# Altium schematic sheet User Interface.SchDoc
size A4
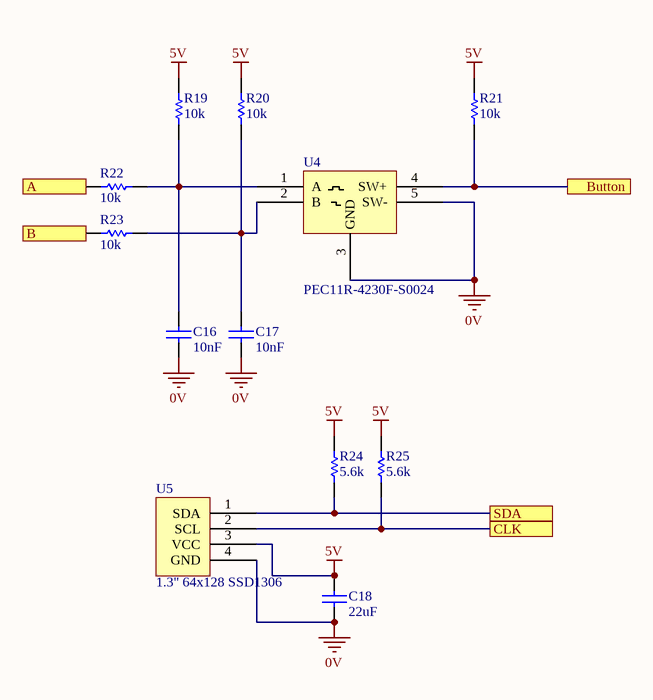
[diagram p0: User Interface.SchDoc]

## Parts
C16  10nF  [0805]
C17  10nF  [0805]
C18  22uF  [1206]
R19  10k  [0805]
R20  10k  [0805]
R21  10k  [0805]
R22  10k  [0805]
R23  10k  [0805]
R24  5.6k  [0805]
R25  5.6k  [0805]
U4  PEC11R-4230F-S0024  [PEC11R-4230F-S0024-ND]
U5  1.3" 64x128 SSD1306  [1.3" 64x128 SSD1306]

## Ports
A, B, Button, CLK, SDA

## Nets
0V: C16.1 C17.1 C18.1 U4.3(GND) U4.5(SW-) U5.4(GND)
5V: C18.2 R19.2 R20.2 R21.2 R24.2 R25.2 U5.3(VCC)
A: R22.1 ; port A
B: R23.1 ; port B
Button: R21.1 U4.4(SW+) ; port Button
CLK: R25.1 U5.2(SCL) ; port CLK
SDA: R24.1 U5.1(SDA) ; port SDA
NetC16_2: C16.2 R19.1 R22.2 U4.1(A)
NetC17_2: C17.2 R20.1 R23.2 U4.2(B)

## Library data of the parts
C16 C17 = GCM2195C1H103JA16D: Manufacturer: muRata; Tolerance: ±5%; Material: C0G, NP0; Rated Voltage: 50V; Part Number: GCM2195C1H103JA16D; Value: 10nF; Digikey Part Number: 490-4783-1-ND
C18 = CC1206MKX5R7BB226: Manufacturer: YAGEO; Tolerance: 20%; Material: Ceramic; Rated Voltage: 16V; Part Number: CC1206MKX5R7BB226; Value: 22uF; Digikey Part Number: 311-1997-2-ND
R19-R23 = RC0805FR0710KL: Manufacturer: YAGEO; Tolerance: 0.01; Rated Voltage: 0.125W; Part Number: RC0805FR0710KL; Value: 10k; Material: FR-07; Digikey Part Number: 311-10.0KCRCT-ND
R24 R25 = RC0805FR075K6L: Manufacturer: YAGEO; Tolerance: 0.01; Rated Voltage: 0.125W; Part Number: RC0805FR075K6L; Value: 5.6k; Material: FR-07; Digikey Part Number: 311-5.60KCRCT-ND
U4 = PEC11R-4230F-S0024: Quadrature Rotary encoder w/ pushbutton; Manufacturer: Bourns Inc.; Part Number: PEC11R-4230F-S0024; Digikey Part Number: PEC11R-4230F-S0024-ND; Digikey Link: https://www.digikey.com/product-detail/en/bourns-inc/PEC11R-4230F-S0024/PEC11R-4230F-S0024-ND/4699230
U5 = 1.3" 64x128 SSD1306: 1.3" I2C OLED display using SSD1306 Driver; Manufacturer: IIC; Part Number: 1.3" 64x128 SSD1306